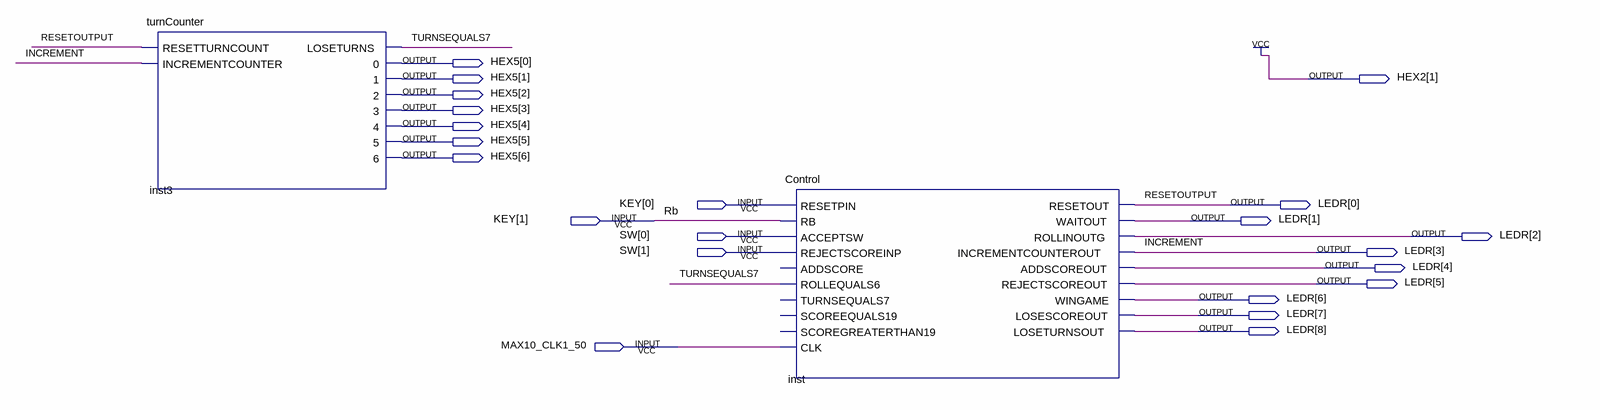
[diagram p0: schematic sheet]
// Quartus schematic Lab6.bdf as structural Verilog: 2 symbols, 22 pins
module Lab6 (
  input  [1:0] KEY,
  input  [1:0] SW,
  input  MAX10_CLK1_50,
  output [6:0] HEX5,
  output [1:1] HEX2,
  output [8:0] LEDR
);

  wire TURNSEQUALS7;

  turnCounter inst3 (
    .RESETTURNCOUNT(LEDR[0]), .INCREMENTCOUNTER(LEDR[3]), .LOSETURNS(TURNSEQUALS7), .\0 (HEX5[0]),
    .\1 (HEX5[1]), .\2 (HEX5[2]), .\3 (HEX5[3]), .\4 (HEX5[4]), .\5 (HEX5[5]), .\6 (HEX5[6]));
  Control inst (
    .RESETPIN(KEY[0]), .RB(KEY[1]), .ACCEPTSW(SW[0]), .REJECTSCOREINP(SW[1]), .ROLLEQUALS6(TURNSEQUALS7),
    .CLK(MAX10_CLK1_50), .RESETOUT(LEDR[0]), .WAITOUT(LEDR[1]), .ROLLINOUTG(LEDR[2]),
    .INCREMENTCOUNTEROUT(LEDR[3]), .ADDSCOREOUT(LEDR[4]), .REJECTSCOREOUT(LEDR[5]), .WINGAME(LEDR[6]),
    .LOSESCOREOUT(LEDR[7]), .LOSETURNSOUT(LEDR[8]));  // open: ADDSCORE, TURNSEQUALS7, SCOREEQUALS19, SCOREGREATERTHAN19

  assign HEX2[1] = 1'b1;

  // Other names for the same wires on the sheet: INCREMENT = LEDR[3]; Rb = KEY[1]; RESETOUTPUT = LEDR[0]
endmodule
